# EAGLE schematic royer (EAGLE 7.6.0)
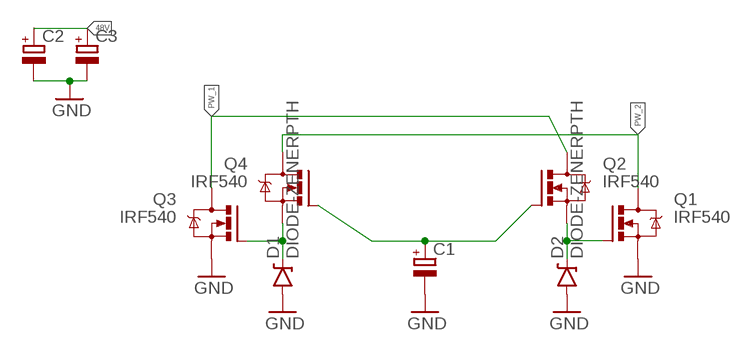
[diagram p0: schematic, sheet 1]

## Parts
C1  CPOL-EUSANYO_C  [SANYO-OSCON_C]
C2  CPOL-EUSANYO_9F  [SANYO-OSCON_9F]
C3  CPOL-EUSANYO_9F  [SANYO-OSCON_9F]
D1  DIODE-ZENERPTH  [DIODE-ZENER]
D2  DIODE-ZENERPTH  [DIODE-ZENER]
Q1  IRF540  [TO220BV]
Q2  IRF540  [TO220BV]
Q3  IRF540  [TO220BV]
Q4  IRF540  [TO220BV]

## Nets
15V: C1.+ Q2.G Q4.G
48V: C2.+ C3.+
GND: C1.- C2.- C3.- D1.P$2(A) D2.P$2(A) Q1.S Q3.S
N$1: D1.P$1(C) Q3.G Q4.S
N$2: D2.P$1(C) Q1.G Q2.S
PW_1: Q2.D Q3.D
PW_2: Q1.D Q4.D

## Library data of the parts
C1-C3 = rcl:CPOL-EU: POLARIZED CAPACITOR, European symbol
D1 D2 = SparkFun-DiscreteSemi:DIODE-ZENER: Zener Diode Production Part - 8199 3.4V Zener Voltage
Q1-Q4 = transistor-power:IRF540: HEXFET Power MOSFET